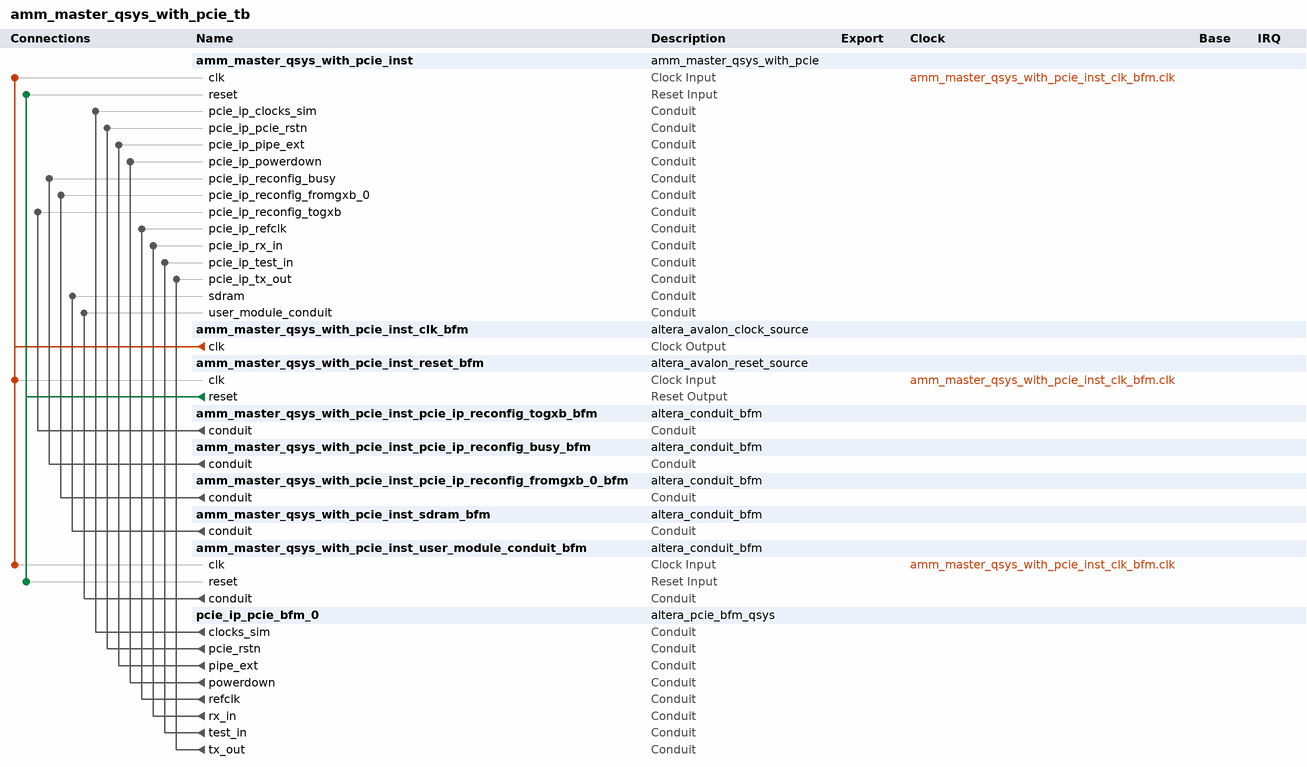
[diagram p0: system contents]
# Platform Designer (Qsys) system amm_master_qsys_with_pcie_tb, Cyclone IV GX EP4CGX150DF31C7
# Parameters at their usual value, and those the tool derives, are not listed.
package require -exact qsys 13.0
create_system amm_master_qsys_with_pcie_tb
set_project_property DEVICE_FAMILY {Cyclone IV GX}
set_project_property DEVICE EP4CGX150DF31C7

add_instance amm_master_qsys_with_pcie_inst amm_master_qsys_with_pcie 1.0

add_instance amm_master_qsys_with_pcie_inst_clk_bfm altera_avalon_clock_source 13.0

add_instance amm_master_qsys_with_pcie_inst_reset_bfm altera_avalon_reset_source 13.0
set_instance_parameter_value amm_master_qsys_with_pcie_inst_reset_bfm ASSERT_HIGH_RESET 0
set_instance_parameter_value amm_master_qsys_with_pcie_inst_reset_bfm INITIAL_RESET_CYCLES 50

add_instance amm_master_qsys_with_pcie_inst_pcie_ip_reconfig_togxb_bfm altera_conduit_bfm 13.0
set_instance_parameter_value amm_master_qsys_with_pcie_inst_pcie_ip_reconfig_togxb_bfm CLOCKED_SIGNAL false
set_instance_parameter_value amm_master_qsys_with_pcie_inst_pcie_ip_reconfig_togxb_bfm ENABLE_RESET false
set_instance_parameter_value amm_master_qsys_with_pcie_inst_pcie_ip_reconfig_togxb_bfm SIGNAL_ROLES data
set_instance_parameter_value amm_master_qsys_with_pcie_inst_pcie_ip_reconfig_togxb_bfm SIGNAL_WIDTHS 4
set_instance_parameter_value amm_master_qsys_with_pcie_inst_pcie_ip_reconfig_togxb_bfm SIGNAL_DIRECTIONS output

add_instance amm_master_qsys_with_pcie_inst_pcie_ip_reconfig_busy_bfm altera_conduit_bfm 13.0
set_instance_parameter_value amm_master_qsys_with_pcie_inst_pcie_ip_reconfig_busy_bfm CLOCKED_SIGNAL false
set_instance_parameter_value amm_master_qsys_with_pcie_inst_pcie_ip_reconfig_busy_bfm ENABLE_RESET false
set_instance_parameter_value amm_master_qsys_with_pcie_inst_pcie_ip_reconfig_busy_bfm SIGNAL_ROLES busy_altgxb_reconfig
set_instance_parameter_value amm_master_qsys_with_pcie_inst_pcie_ip_reconfig_busy_bfm SIGNAL_WIDTHS 1
set_instance_parameter_value amm_master_qsys_with_pcie_inst_pcie_ip_reconfig_busy_bfm SIGNAL_DIRECTIONS output

add_instance amm_master_qsys_with_pcie_inst_pcie_ip_reconfig_fromgxb_0_bfm altera_conduit_bfm 13.0
set_instance_parameter_value amm_master_qsys_with_pcie_inst_pcie_ip_reconfig_fromgxb_0_bfm CLOCKED_SIGNAL false
set_instance_parameter_value amm_master_qsys_with_pcie_inst_pcie_ip_reconfig_fromgxb_0_bfm ENABLE_RESET false
set_instance_parameter_value amm_master_qsys_with_pcie_inst_pcie_ip_reconfig_fromgxb_0_bfm SIGNAL_ROLES data
set_instance_parameter_value amm_master_qsys_with_pcie_inst_pcie_ip_reconfig_fromgxb_0_bfm SIGNAL_WIDTHS 5
set_instance_parameter_value amm_master_qsys_with_pcie_inst_pcie_ip_reconfig_fromgxb_0_bfm SIGNAL_DIRECTIONS input

add_instance amm_master_qsys_with_pcie_inst_sdram_bfm altera_conduit_bfm 13.0
set_instance_parameter_value amm_master_qsys_with_pcie_inst_sdram_bfm CLOCKED_SIGNAL false
set_instance_parameter_value amm_master_qsys_with_pcie_inst_sdram_bfm ENABLE_RESET false
set_instance_parameter_value amm_master_qsys_with_pcie_inst_sdram_bfm SIGNAL_ROLES addr,ba,cas_n,cke,cs_n,dq,dqm,ras_n,we_n
set_instance_parameter_value amm_master_qsys_with_pcie_inst_sdram_bfm SIGNAL_WIDTHS 12,2,1,1,1,32,4,1,1
set_instance_parameter_value amm_master_qsys_with_pcie_inst_sdram_bfm SIGNAL_DIRECTIONS input,input,input,input,input,bidir,input,input,input

add_instance amm_master_qsys_with_pcie_inst_user_module_conduit_bfm altera_conduit_bfm 13.0
set_instance_parameter_value amm_master_qsys_with_pcie_inst_user_module_conduit_bfm CLOCKED_SIGNAL true
set_instance_parameter_value amm_master_qsys_with_pcie_inst_user_module_conduit_bfm ENABLE_RESET true
set_instance_parameter_value amm_master_qsys_with_pcie_inst_user_module_conduit_bfm SIGNAL_ROLES rdwr_cntl,n_action,add_data_sel,rdwr_address,debug_flag,display_data
set_instance_parameter_value amm_master_qsys_with_pcie_inst_user_module_conduit_bfm SIGNAL_WIDTHS 1,1,1,28,16,32
set_instance_parameter_value amm_master_qsys_with_pcie_inst_user_module_conduit_bfm SIGNAL_DIRECTIONS output,output,output,output,input,input

add_instance pcie_ip_pcie_bfm_0 altera_pcie_bfm_qsys 13.0
set_instance_parameter_value pcie_ip_pcie_bfm_0 LINK_WIDTH 1
set_instance_parameter_value pcie_ip_pcie_bfm_0 TEST_OUT_WIDTH None

# connections
add_connection amm_master_qsys_with_pcie_inst_clk_bfm.clk amm_master_qsys_with_pcie_inst.clk clock
add_connection amm_master_qsys_with_pcie_inst_clk_bfm.clk amm_master_qsys_with_pcie_inst_reset_bfm.clk clock
add_connection amm_master_qsys_with_pcie_inst_clk_bfm.clk amm_master_qsys_with_pcie_inst_user_module_conduit_bfm.clk clock
add_connection amm_master_qsys_with_pcie_inst_reset_bfm.reset amm_master_qsys_with_pcie_inst.reset reset
add_connection amm_master_qsys_with_pcie_inst_reset_bfm.reset amm_master_qsys_with_pcie_inst_user_module_conduit_bfm.reset reset
add_connection amm_master_qsys_with_pcie_inst_pcie_ip_reconfig_busy_bfm.conduit amm_master_qsys_with_pcie_inst.pcie_ip_reconfig_busy conduit
add_connection amm_master_qsys_with_pcie_inst_pcie_ip_reconfig_fromgxb_0_bfm.conduit amm_master_qsys_with_pcie_inst.pcie_ip_reconfig_fromgxb_0 conduit
add_connection amm_master_qsys_with_pcie_inst_pcie_ip_reconfig_togxb_bfm.conduit amm_master_qsys_with_pcie_inst.pcie_ip_reconfig_togxb conduit
add_connection amm_master_qsys_with_pcie_inst_sdram_bfm.conduit amm_master_qsys_with_pcie_inst.sdram conduit
add_connection amm_master_qsys_with_pcie_inst_user_module_conduit_bfm.conduit amm_master_qsys_with_pcie_inst.user_module_conduit conduit
add_connection pcie_ip_pcie_bfm_0.clocks_sim amm_master_qsys_with_pcie_inst.pcie_ip_clocks_sim conduit
add_connection pcie_ip_pcie_bfm_0.pcie_rstn amm_master_qsys_with_pcie_inst.pcie_ip_pcie_rstn conduit
add_connection pcie_ip_pcie_bfm_0.pipe_ext amm_master_qsys_with_pcie_inst.pcie_ip_pipe_ext conduit
add_connection pcie_ip_pcie_bfm_0.powerdown amm_master_qsys_with_pcie_inst.pcie_ip_powerdown conduit
add_connection pcie_ip_pcie_bfm_0.refclk amm_master_qsys_with_pcie_inst.pcie_ip_refclk conduit
add_connection pcie_ip_pcie_bfm_0.rx_in amm_master_qsys_with_pcie_inst.pcie_ip_rx_in conduit
add_connection pcie_ip_pcie_bfm_0.test_in amm_master_qsys_with_pcie_inst.pcie_ip_test_in conduit
add_connection pcie_ip_pcie_bfm_0.tx_out amm_master_qsys_with_pcie_inst.pcie_ip_tx_out conduit

set_interconnect_requirement {$system} qsys_mm.clockCrossingAdapter HANDSHAKE
set_interconnect_requirement {$system} qsys_mm.maxAdditionalLatency 1

save_system amm_master_qsys_with_pcie_tb.qsys
